# EAGLE design LCD-OLINUXINO-10''TS (EAGLE 4.16)
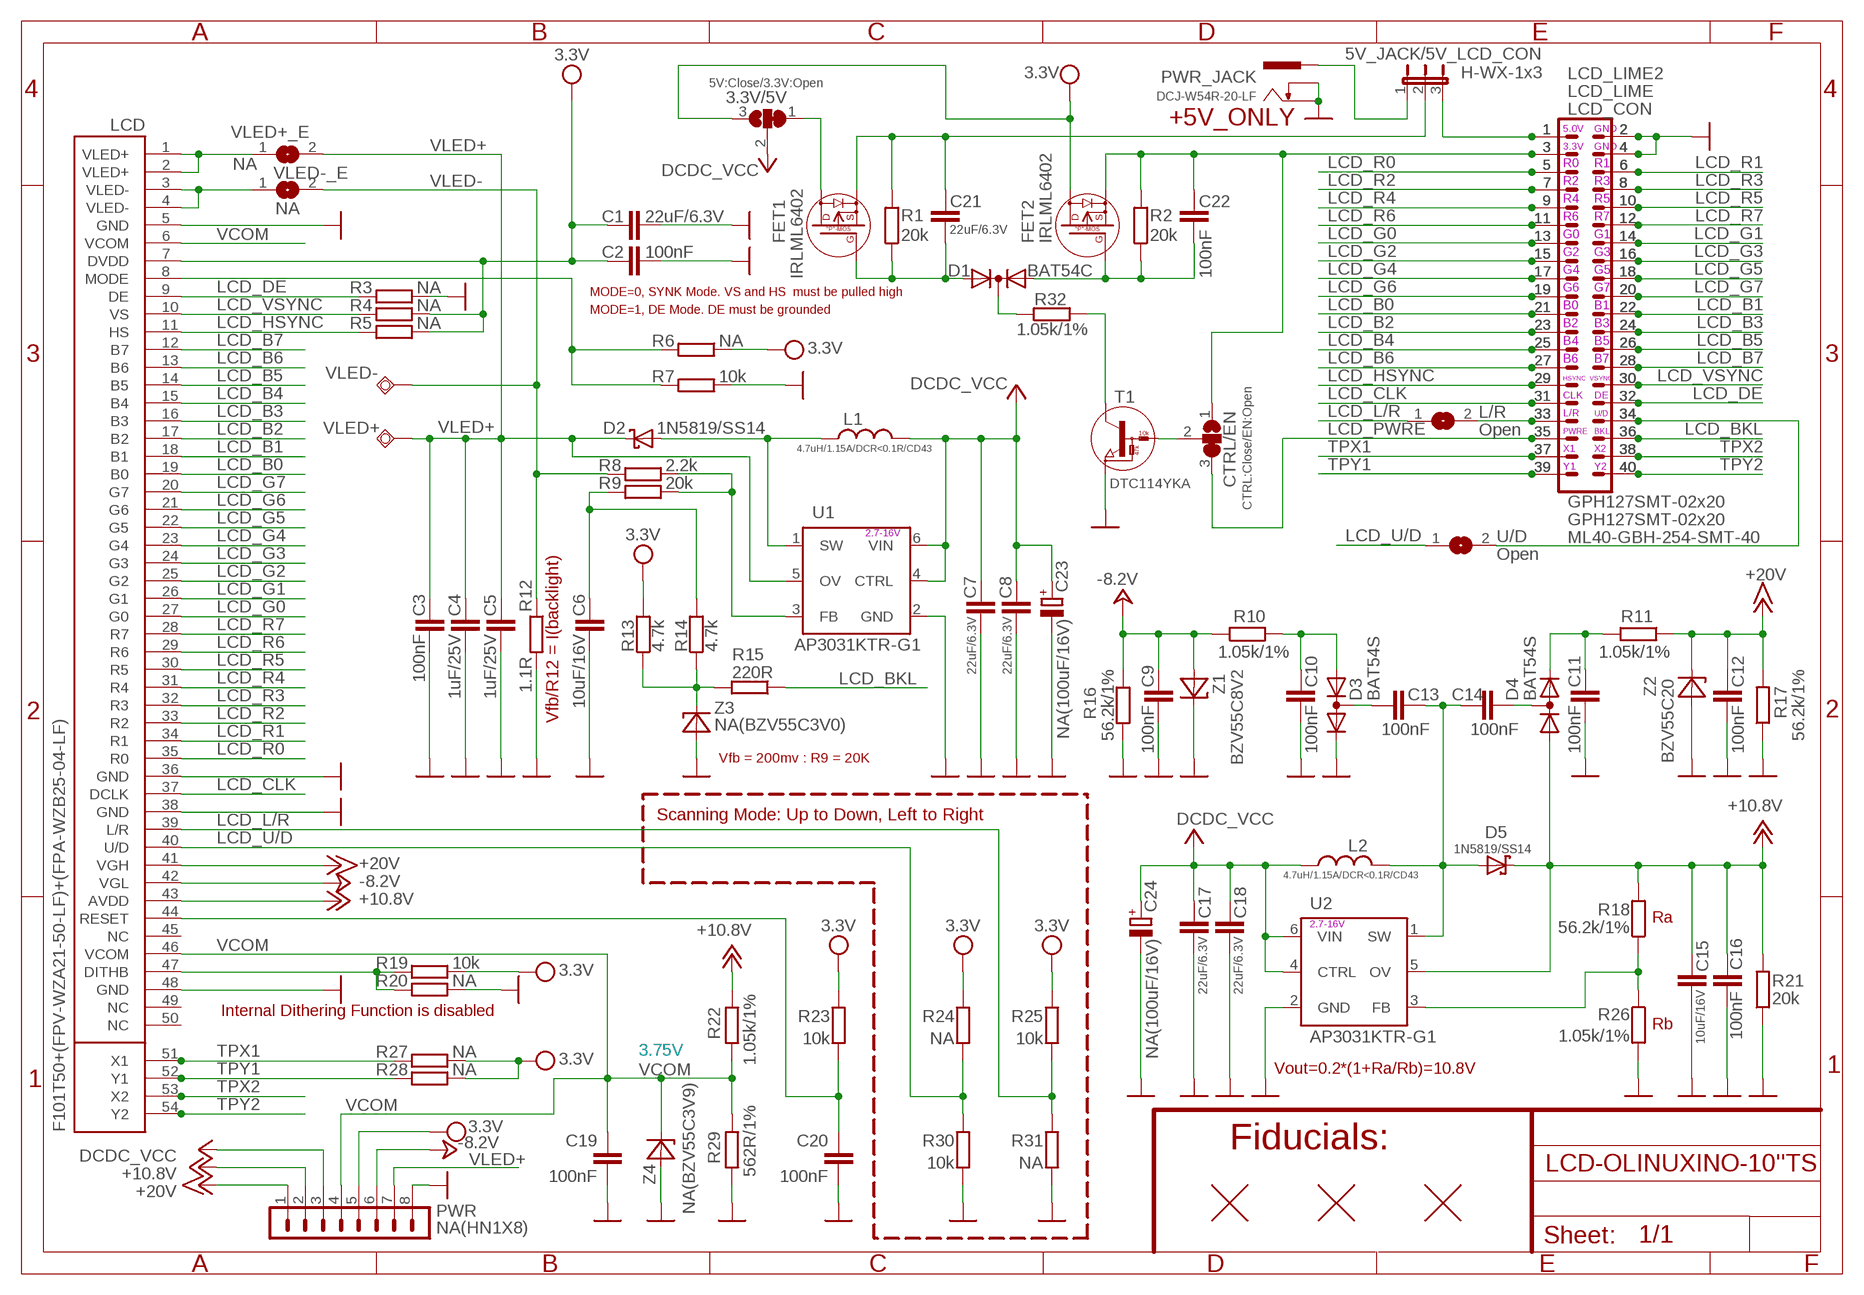
[diagram p0: schematic, sheet 1]

## Parts
3.3V/5V  5V:Close/3.3V:Open  SJ2W6  [SJ_2_SMALL_12_TIED]
5V_JACK/5V_LCD_CON  H-WX-1x3  JP2EHN1X3-SMD  [HN1X3-SMD]
C1  22uF/6.3V  C-EUC0805_5MIL_DWS  [C0805_5MIL_DWS]
C2  100nF  C-EUC0603_DWS  [C0603_DWS]
C3  100nF  C-EUC0603_DWS  [C0603_DWS]
C4  1uF/25V  C-EUC0805_5MIL_DWS  [C0805_5MIL_DWS]
C5  1uF/25V  C-EUC0805_5MIL_DWS  [C0805_5MIL_DWS]
C6  10uF/16V  C-EUC0805_5MIL_DWS  [C0805_5MIL_DWS]
C7  22uF/6.3V  C-EUC0805_5MIL_DWS  [C0805_5MIL_DWS]
C8  22uF/6.3V  C-EUC0805_5MIL_DWS  [C0805_5MIL_DWS]
C9  100nF  C-EUC0603_DWS  [C0603_DWS]
C10  100nF  C-EUC0603_DWS  [C0603_DWS]
C11  100nF  C-EUC0603_DWS  [C0603_DWS]
C12  100nF  C-EUC0603_DWS  [C0603_DWS]
C13  100nF  C-EUC0603_DWS  [C0603_DWS]
C14  100nF  C-EUC0603_DWS  [C0603_DWS]
C15  10uF/16V  C-EUC0805_5MIL_DWS  [C0805_5MIL_DWS]
C16  100nF  C-EUC0603_DWS  [C0603_DWS]
C17  22uF/6.3V  C-EUC0805_5MIL_DWS  [C0805_5MIL_DWS]
C18  22uF/6.3V  C-EUC0805_5MIL_DWS  [C0805_5MIL_DWS]
C19  100nF  C-EUC0603_DWS  [C0603_DWS]
C20  100nF  C-EUC0603_DWS  [C0603_DWS]
C21  22uF/6.3V  C-EUC0603_DWS  [C0603_DWS]
C22  100nF  C-EUC0603_DWS  [C0603_DWS]
C23  NA(100uF/16V)  CPOL-EUC-SMD5X11-M  [C-SMD5X11-M]
C24  NA(100uF/16V)  CPOL-EUC-SMD5X11-M  [C-SMD5X11-M]
CTRL/EN  CTRL:Close/EN:Open  SJ2W5  [SJ_2_SMALL_23_TIED]
D1  BAT54C  DIODE_AC-CA_  [SOT23C]
D2  1N5819/SS14  SCHOTKKY7.62SS2  [MLL-41]
D3  BAT54S  DIODE_AC-AC_  [SOT23C(BAT54S)]
D4  BAT54S  DIODE_AC-AC_  [SOT23C(BAT54S)]
D5  1N5819/SS14  SCHOTKKY7.62SS2  [MLL-41]
FET1  IRLML6402  P-MOS+DIODIRLML6402  [SOT23]
FET2  IRLML6402  P-MOS+DIODIRLML6402  [SOT23]
L1  4.7uH/1.15A/DCR<0.1R/CD43  L-CD42(43)  [CD42(43)]
L2  4.7uH/1.15A/DCR<0.1R/CD43  L-CD42(43)  [CD42(43)]
L/R  Open  SJ  [SJ]
LCD  F101T50+(FPV-WZA21-50-LF)+(FPA-WZB25-04-LF)  LCD10"_TOUCH-F101T50  [LCD10"_TOUCH(F101T50)]
LCD_CON  ML40-GBH-254-SMT-40  [ML40-MALE(GBH-254-SMT-40)]
LCD_LIME  GPH127SMT-02x20  ML40YA-V36P-2X20-LF  [YA-V36P-2X20-LF]
LCD_LIME2  GPH127SMT-02x20  ML40-GPH127SMT-02X20(PA-V16X-2X20-LF)  [GPH127SMT-02X20(PA-V16X-2X20-LF)]
PWR  NA(HN1X8)  CON8HN1X8  [HN1X8]
PWR_JACK  DCJ-W54R-20-LF  PWR-JAKDCJ-W  [PWR-JACK-SMD]
R1  20k  R-EU_R0603_5MIL_DWS  [R0603_5MIL_DWS]
R2  20k  R-EU_R0603_5MIL_DWS  [R0603_5MIL_DWS]
R3  NA  R-EU_R0603_5MIL_DWS  [R0603_5MIL_DWS]
R4  NA  R-EU_R0603_5MIL_DWS  [R0603_5MIL_DWS]
R5  NA  R-EU_R0603_5MIL_DWS  [R0603_5MIL_DWS]
R6  NA  R-EU_R0603_5MIL_DWS  [R0603_5MIL_DWS]
R7  10k  R-EU_R0603_5MIL_DWS  [R0603_5MIL_DWS]
R8  2.2k  R-EU_R0603_5MIL_DWS  [R0603_5MIL_DWS]
R9  20k  R-EU_R0603_5MIL_DWS  [R0603_5MIL_DWS]
R10  1.05k/1%  R-EU_R0603_5MIL_DWS  [R0603_5MIL_DWS]
R11  1.05k/1%  R-EU_R0603_5MIL_DWS  [R0603_5MIL_DWS]
R12  1.1R  R-EU_R0603_5MIL_DWS  [R0603_5MIL_DWS]
R13  4.7k  R-EU_R0603_5MIL_DWS  [R0603_5MIL_DWS]
R14  4.7k  R-EU_R0603_5MIL_DWS  [R0603_5MIL_DWS]
R15  220R  R-EU_R0603_5MIL_DWS  [R0603_5MIL_DWS]
R16  56.2k/1%  R-EU_R0603_5MIL_DWS  [R0603_5MIL_DWS]
R17  56.2k/1%  R-EU_R0603_5MIL_DWS  [R0603_5MIL_DWS]
R18  56.2k/1%  R-EU_R0603_5MIL_DWS  [R0603_5MIL_DWS]
R19  10k  R-EU_R0603_5MIL_DWS  [R0603_5MIL_DWS]
R20  NA  R-EU_R0603_5MIL_DWS  [R0603_5MIL_DWS]
R21  20k  R-EU_R0603_5MIL_DWS  [R0603_5MIL_DWS]
R22  1.05k/1%  R-EU_R0603_5MIL_DWS  [R0603_5MIL_DWS]
R23  10k  R-EU_R0603_5MIL_DWS  [R0603_5MIL_DWS]
R24  NA  R-EU_R0603_5MIL_DWS  [R0603_5MIL_DWS]
R25  10k  R-EU_R0603_5MIL_DWS  [R0603_5MIL_DWS]
R26  1.05k/1%  R-EU_R0603_5MIL_DWS  [R0603_5MIL_DWS]
R27  NA  R-EU_R0603_5MIL_DWS  [R0603_5MIL_DWS]
R28  NA  R-EU_R0603_5MIL_DWS  [R0603_5MIL_DWS]
R29  562R/1%  R-EU_R0603_5MIL_DWS  [R0603_5MIL_DWS]
R30  10k  R-EU_R0603_5MIL_DWS  [R0603_5MIL_DWS]
R31  NA  R-EU_R0603_5MIL_DWS  [R0603_5MIL_DWS]
R32  1.05k/1%  R-EU_R0603_5MIL_DWS  [R0603_5MIL_DWS]
T1  DTC114YKA  DIGITAL_TRANSISTORS-NPNDTC114YKA  [SOT-23]
U1  AP3031KTR-G1  [SOT23-6]
U2  AP3031KTR-G1  [SOT23-6]
U$1  FIDUCIAL  [FIDUCIAL-1X3]
U$2  FIDUCIAL  [FIDUCIAL-1X3]
U$3  FIDUCIAL  [FIDUCIAL-1X3]
U/D  Open  SJ  [SJ]
VLED+  TESTPAD120X40  [SMD120X40]
VLED+_E  NA  SJ  [SJ]
VLED-  TESTPAD120X40  [SMD120X40]
VLED-_E  NA  SJ  [SJ]
Z1  BZV55C8V2  ZDIOD-SMD  [MINI-MELF]
Z2  BZV55C20  ZDIOD-SMD  [MINI-MELF]
Z3  NA(BZV55C3V0)  ZDIOD-SMD  [MINI-MELF]
Z4  NA(BZV55C3V9)  ZDIOD-SMD  [MINI-MELF]

## Nets
+5V: 3.3V/5V.2 C7.2 C8.2 C17.2 C18.2 C23.+ C24.+ L1.1 L2.1 PWR.3 U1.4(CTRL) U1.6(VIN) U2.4(CTRL) U2.6(VIN) ; supply symbol labelled DCDC_VCC
+12V: C15.1 C16.1 D4.1(A) D5.K(C) LCD.43(AVDD) PWR.2 R18.2 R21.2 R22.1 U2.5(OV) ; supply symbol labelled +10.8V
+15V: C12.1 LCD.41(VGH) PWR.1 R11.1 R17.2 Z2.1(C) ; supply symbol labelled +20V
-24V: C9.1 LCD.42(VGL) PWR.6 R10.1 R16.2 Z1.2(A) ; supply symbol labelled -8.2V
GND [pwr]: C1.2 C2.2 C3.2 C4.2 C5.2 C6.2 C7.1 C8.1 C9.2 C10.2 C11.2 C12.2 C15.2 C16.2 C17.1 C18.1 C19.2 C20.2 C23.- C24.- D3.2(K) LCD.5(GND) LCD.36(GND) LCD.38(GND) LCD.48(GND) LCD_CON.2 LCD_CON.4 LCD_LIME2.2 LCD_LIME2.4 LCD_LIME.2 LCD_LIME.4 PWR.8 PWR_JACK.2(-) PWR_JACK.3(--) R3.1 R7.1 R12.2 R16.1 R17.1 R20.1 R21.1 R26.2 R29.2 R30.2 R31.2 T1.2(E) U1.2(GND) U2.2(GND) Z1.1(C) Z2.2(A) Z3.2(A) Z4.2(A)
LCD_B0: LCD.19(B0) LCD_CON.21 LCD_LIME2.21 LCD_LIME.21
LCD_B1: LCD.18(B1) LCD_CON.22 LCD_LIME2.22 LCD_LIME.22
LCD_B2: LCD.17(B2) LCD_CON.23 LCD_LIME2.23 LCD_LIME.23
LCD_B3: LCD.16(B3) LCD_CON.24 LCD_LIME2.24 LCD_LIME.24
LCD_B4: LCD.15(B4) LCD_CON.25 LCD_LIME2.25 LCD_LIME.25
LCD_B5: LCD.14(B5) LCD_CON.26 LCD_LIME2.26 LCD_LIME.26
LCD_B6: LCD.13(B6) LCD_CON.27 LCD_LIME2.27 LCD_LIME.27
LCD_B7: LCD.12(B7) LCD_CON.28 LCD_LIME2.28 LCD_LIME.28
LCD_BKL: LCD_CON.36 LCD_LIME2.36 LCD_LIME.36 R15.1
LCD_CLK: LCD.37(DCLK) LCD_CON.31 LCD_LIME2.31 LCD_LIME.31
LCD_DE: LCD.9(DE) LCD_CON.32 LCD_LIME2.32 LCD_LIME.32 R3.2
LCD_G0: LCD.27(G0) LCD_CON.13 LCD_LIME2.13 LCD_LIME.13
LCD_G1: LCD.26(G1) LCD_CON.14 LCD_LIME2.14 LCD_LIME.14
LCD_G2: LCD.25(G2) LCD_CON.15 LCD_LIME2.15 LCD_LIME.15
LCD_G3: LCD.24(G3) LCD_CON.16 LCD_LIME2.16 LCD_LIME.16
LCD_G4: LCD.23(G4) LCD_CON.17 LCD_LIME2.17 LCD_LIME.17
LCD_G5: LCD.22(G5) LCD_CON.18 LCD_LIME2.18 LCD_LIME.18
LCD_G6: LCD.21(G6) LCD_CON.19 LCD_LIME2.19 LCD_LIME.19
LCD_G7: LCD.20(G7) LCD_CON.20 LCD_LIME2.20 LCD_LIME.20
LCD_HSYNC: LCD.11(HS) LCD_CON.29 LCD_LIME2.29 LCD_LIME.29 R5.2
LCD_L/R: L/R.1 LCD.39(L/R) R25.2 R31.1
LCD_PWRE: CTRL/EN.3 LCD_CON.35 LCD_LIME2.35 LCD_LIME.35
LCD_R0: LCD.35(R0) LCD_CON.5 LCD_LIME2.5 LCD_LIME.5
LCD_R1: LCD.34(R1) LCD_CON.6 LCD_LIME2.6 LCD_LIME.6
LCD_R2: LCD.33(R2) LCD_CON.7 LCD_LIME2.7 LCD_LIME.7
LCD_R3: LCD.32(R3) LCD_CON.8 LCD_LIME2.8 LCD_LIME.8
LCD_R4: LCD.31(R4) LCD_CON.9 LCD_LIME2.9 LCD_LIME.9
LCD_R5: LCD.30(R5) LCD_CON.10 LCD_LIME2.10 LCD_LIME.10
LCD_R6: LCD.29(R6) LCD_CON.11 LCD_LIME2.11 LCD_LIME.11
LCD_R7: LCD.28(R7) LCD_CON.12 LCD_LIME2.12 LCD_LIME.12
LCD_U/D: LCD.40(U/D) R24.2 R30.1 U/D.1
LCD_VSYNC: LCD.10(VS) LCD_CON.30 LCD_LIME2.30 LCD_LIME.30 R4.2
N$1: LCD.8(MODE) R6.2 R7.2
N$2: C14.2 D4.3(AK)
N$3 [pwr]: C22.1 CTRL/EN.1 FET2.2(S) LCD_CON.3 LCD_LIME2.3 LCD_LIME.3 R2.2
N$4: C11.1 D4.2(K) R11.2
N$5: R8.1 R9.1 U1.3(FB)
N$6: C10.1 D3.1(A) R10.2
N$7: 5V_JACK/5V_LCD_CON.2 C21.1 FET1.2(S) R1.2
N$8: C22.2 D1.1(A1) FET2.1(G) R2.1
N$9: C21.2 D1.2(A2) FET1.1(G) R1.1
N$10: C13.1 D3.3(AK)
N$11: R32.1 T1.3(C)
N$12: C6.1 R9.2 R14.2
N$13: D2.A L1.2 U1.1(SW)
N$14: R13.1 R14.1 R15.2 Z3.1(C)
N$15: L/R.2 LCD_CON.33 LCD_LIME2.33 LCD_LIME.33
N$16: CTRL/EN.2 T1.1(B)
N$17: LCD_CON.34 LCD_LIME2.34 LCD_LIME.34 U/D.2
N$18: 3.3V/5V.1 FET1.3(D)
N$19: D1.3(K) R32.2
N$20: 5V_JACK/5V_LCD_CON.3 LCD_CON.1 LCD_LIME2.1 LCD_LIME.1
N$21: LCD.1(VLED+) LCD.2(VLED+) VLED+_E.1
N$22: 5V_JACK/5V_LCD_CON.1 PWR_JACK.1(+)
N$23: LCD.3(VLED-) LCD.4(VLED-) VLED-_E.1
N$42: LCD.47(DITHB) R19.2 R20.2
N$123: C13.2 C14.1 D5.A L2.2 U2.1(SW)
N$126: R18.1 R26.1 U2.3(FB)
RESET: C20.1 LCD.44(RESET) R23.2
TPX1: LCD.51(X1) LCD.55(X1_1) LCD_CON.37 LCD_LIME2.37 LCD_LIME.37 R27.2
TPX2: LCD.53(X2) LCD.57(X2_2) LCD_CON.38 LCD_LIME2.38 LCD_LIME.38
TPY1: LCD.52(Y1) LCD.56(Y1_1) LCD_CON.39 LCD_LIME2.39 LCD_LIME.39 R28.2
TPY2: LCD.54(Y2) LCD.58(Y2_2) LCD_CON.40 LCD_LIME2.40 LCD_LIME.40
VCC [pwr]: 3.3V/5V.3 C1.1 C2.1 FET2.3(D) LCD.7(DVDD) PWR.5 R4.1 R5.1 R6.1 R13.2 R19.1 R23.1 R24.1 R25.1 R27.1 R28.1 ; supply symbol labelled 3.3V
VCOM: C19.1 LCD.6(VCOM) LCD.46(VCOM) PWR.4 R22.2 R29.1 Z4.1(C)
VLED+: C3.1 C4.1 C5.1 D2.K(C) PWR.7 U1.5(OV) VLED+.1(PP) VLED+_E.2
VLED-: R8.2 R12.1 VLED-.1(PP) VLED-_E.2
Unconnected: LCD.45(NC) LCD.49(NC) LCD.50(NC)

## Notes on the sheet
- +5V_ONLY
- 5.0V | GND
- 3.3V | GND
- R0 | R1
- R2 | R3
- R4 | R5
- R6 | R7
- G0 | G1
- G2 | G3
- G4 | G5
- G6 | G7
- MODE=0, SYNK Mode. VS and HS  must be pulled high
- B0 | B1
- MODE=1, DE Mode. DE must be grounded
- B2 | B3
- B4 | B5
- B6 | B7
- HSYNC | VSYNC
- CLK | DE
- L/R | U/D
- PWRE | BKL
- X1 | X2
- Y1 | Y2
- 2.7-16V
- Vfb/R12 = I(backlight)
- Vfb = 200mv : R9 = 20K
- Scanning Mode: Up to Down, Left to Right
- Ra
- 2.7-16V
- Internal Dithering Function is disabled
- Rb
- 3.75V
- Vout=0.2*(1+Ra/Rb)=10.8V
- Fiducials:

## Library data of the parts
3.3V/5V CTRL/EN = jumper:SJ2W: SMD solder JUMPER
5V_JACK/5V_LCD_CON = jumper:JP2E: JUMPER
C1-C22 = rcl:C-EU: CAPACITOR, European symbol
C23 C24 = rcl:CPOL-EU: POLARIZED CAPACITOR, European symbol
D1 = semicon-smd-ipc:DIODE_AC-CA_: DUAL DIODE
D2 D5 = gogo:SCHOTKKY7.62SS
D3 D4 = semicon-smd-ipc:DIODE_AC-AC_: DUAL DIODE
FET1 FET2 = Penko:P-MOS+DIOD
L1 L2 = OLIMEX_DISCRET:L
L/R U/D VLED+_E VLED-_E = jumper:SJ: SMD solder JUMPER
LCD = olimex_lcd:LCD10"_TOUCH
LCD_CON LCD_LIME LCD_LIME2 = con-harting-ml:ML40: HARTING
PWR = Penko:CON8
PWR_JACK = gogo:PWR-JAK
R1-R32 = rcl:R-EU_: RESISTOR, European symbol
T1 = OLIMEX_DISCRET:DIGITAL_TRANSISTORS-NPN: DTC114YKA Digital Transistor - NPN
U1 U2 = OLIMEX_IC:AP3031
U$1-U$3 = SparkFunEagle-6-6-07:FIDUCIAL: Fiducial Alignment Points Various fiducial points for machine vision alignment.
VLED+ VLED- = gogo:TESTPAD: drill 40mils, diameter 70mils
Z1-Z4 = gogo:ZDIOD-SMD

## Net classes
1 pwr: width 0.254 mm, drill 0.241 mm, clearance 0.254 mm

## Board
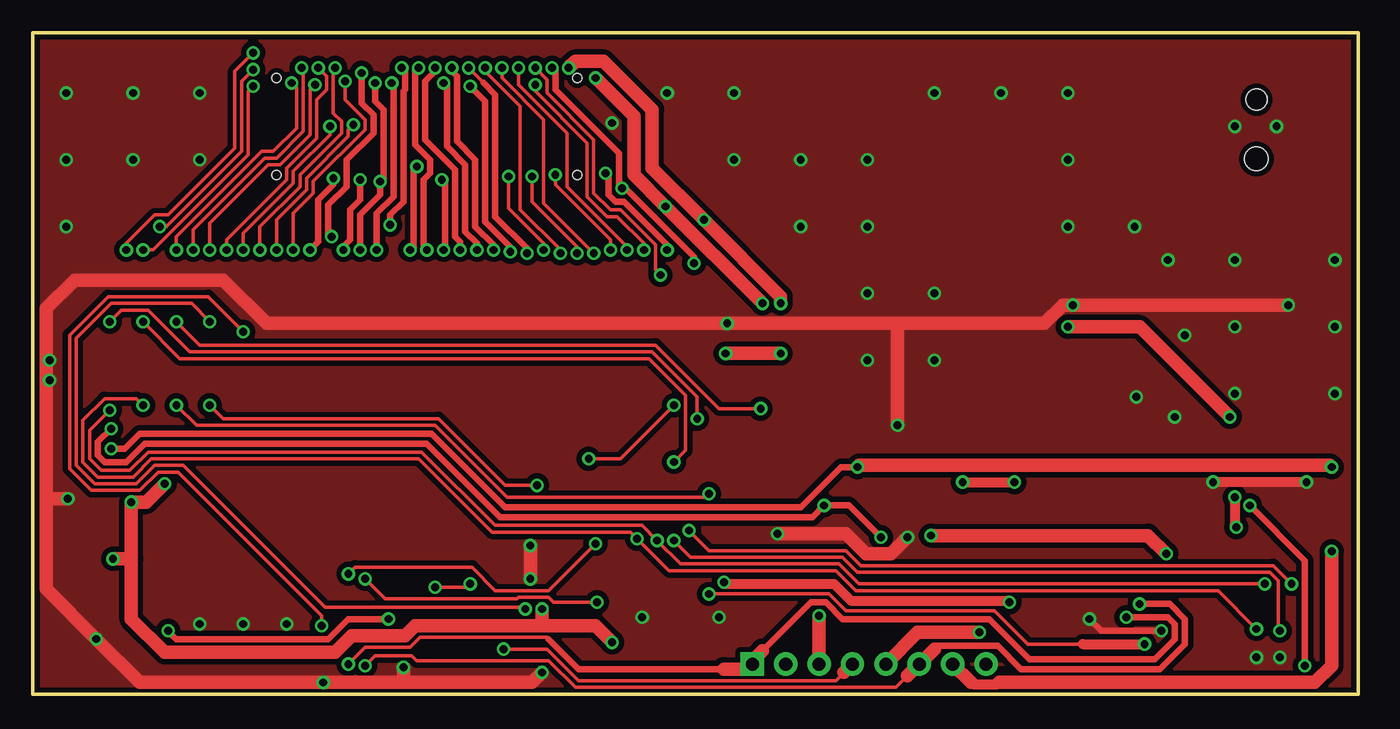
[diagram p1: board, top side]
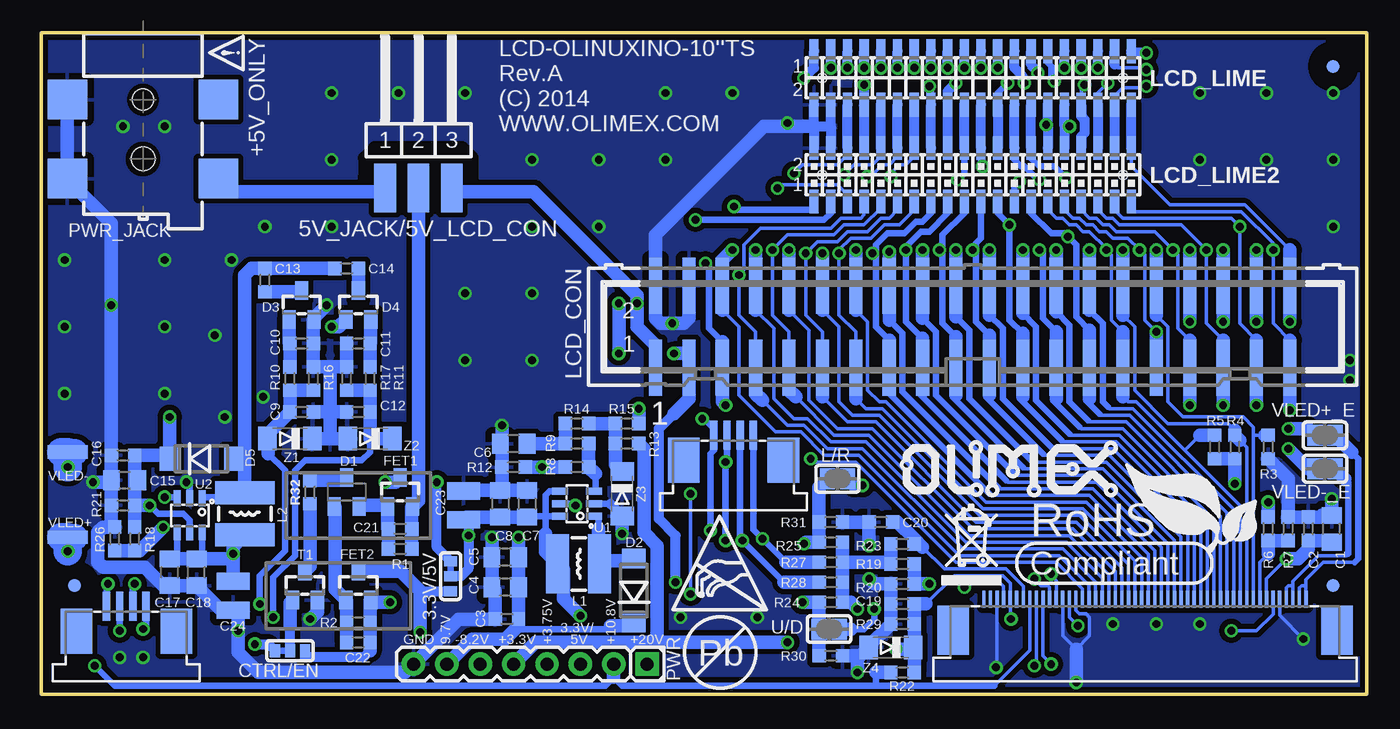
[diagram p2: board, bottom side, seen from below]

Size 100.84 x 50.29 mm. Coordinates in mm from the lower left corner, seen from the top.
Outline: 0,0 100.84,0 100.84,50.29 0,50.29 0,0
Copper layers (1+16): Top 0.035mm / dielectric 1.5mm / Bottom 0.035mm
Design rules "default": minimum track width 9.5mil, minimum drill 0.6mm, track to track 9.5mil, track to pad 9.5mil, pad to pad 9.5mil, via to via 9.5mil, smd to smd 1mil, copper to edge 10mil, drill to drill 8mil, minimum pad ring 8mil, minimum via ring 8mil, stop-mask expansion 4mil, vias tented up to drill 25mil, thermal gap 20mil
bRestrict: 5 lines

### Footprints (pad centres in the part's own frame; a part is rotated, then mirrored left to right if it is on the bottom)
SJ_2_SMALL_12_TIED = smd 0.762 x 1.016: 1 -1.143,0; 2 0,0; 3 1.143,0
HN1X3-SMD = smd 1.651 x 3.683: 1 -2.54,-0.229; 2 0,-0.229; 3 2.54,-0.229
C0805_5MIL_DWS = smd 1.27 x 1.524: 1 -1.016,0; 2 1.016,0
C0603_DWS = smd 1.016 x 1.016: 1 -0.889,0; 2 0.889,0
C-SMD5X11-M = smd 2.5 x 1.3: + 0,-1.1; - 0,1.1
SJ_2_SMALL_23_TIED = smd 0.762 x 1.016: 1 -1.143,0; 2 0,0; 3 1.143,0
SOT23C = smd 1.4 x 1: 1 1.1,-0.95; 2 1.1,0.95; 3 -1.1,0
MLL-41 = smd 1.45 x 1.8: A 2.445,0; K -2.445,0
SOT23C(BAT54S) = smd 1.4 x 1: 1 1.1,-0.95; 2 1.1,0.95; 3 -1.1,0
SOT23 = smd 1.4 x 1: 1 1.1,-0.95; 2 1.1,0.95; 3 -1.1,0
CD42(43) = smd 1.75 x 4.5: 1 -1.6,0; 2 1.6,0
SJ = smd 1.168 x 1.6: 1 -0.762,0; 2 0.762,0
LCD10"_TOUCH(F101T50) = smd 0.25 x 1.3 bottom: 1 104.95,54.35; 2 105.45,54.35; 3 105.95,54.35; 4 106.45,54.35; 5 106.95,54.35; 6 107.45,54.35; 7 107.95,54.35; 8 108.45,54.35; 9 108.95,54.35; 10 109.45,54.35; 11 109.95,54.35; 12 110.45,54.35; 13 110.95,54.35; 14 111.45,54.35; 15 111.95,54.35; 16 112.45,54.35; 17 112.95,54.35; 18 113.45,54.35; 19 113.95,54.35; 20 114.45,54.35; 21 114.95,54.35; 22 115.45,54.35; 23 115.95,54.35; 24 116.45,54.35; 25 116.95,54.35; 26 117.45,54.35; 27 117.95,54.35; 28 118.45,54.35; 29 118.95,54.35; 30 119.45,54.35; 31 119.95,54.35; 32 120.45,54.35; 33 120.95,54.35; 34 121.45,54.35; 35 121.95,54.35; 36 122.45,54.35; 37 122.95,54.35; 38 123.45,54.35; 39 123.95,54.35; 40 124.45,54.35; 41 124.95,54.35; 42 125.45,54.35; 43 125.95,54.35; 44 126.45,54.35; 45 126.95,54.35; 46 127.45,54.35; 47 127.95,54.35; 48 128.45,54.35; 49 128.95,54.35; 50 129.45,54.35 | smd 0.55 x 2.2 bottom: 51 193.195,53.799; 52 194.195,53.799; 53 195.195,53.799; 54 196.195,53.799; 55 146.995,66.799; 56 147.995,66.799; 57 148.995,66.799; 58 149.995,66.799 | smd 2.4 x 3.7 bottom: P1 131.8,51.975; P2 102.6,51.975 | smd 2.4 x 3.4 bottom: P3 190.895,51.899; P4 198.495,51.899; P5 144.695,64.899; P6 152.295,64.899
ML40-MALE(GBH-254-SMT-40) = smd 1 x 4.25: 1 -24.13,-3.125; 2 -24.13,3.125; 3 -21.59,-3.125; 4 -21.59,3.125; 5 -19.05,-3.125; 6 -19.05,3.125; 7 -16.51,-3.125; 8 -16.51,3.125; 9 -13.97,-3.125; 10 -13.97,3.125; 11 -11.43,-3.125; 12 -11.43,3.125; 13 -8.89,-3.125; 14 -8.89,3.125; 15 -6.35,-3.125; 16 -6.35,3.125; 17 -3.81,-3.125; 18 -3.81,3.125; 19 -1.27,-3.125; 20 -1.27,3.125; 21 1.27,-3.125; 22 1.27,3.125; 23 3.81,-3.125; 24 3.81,3.125; 25 6.35,-3.125; 26 6.35,3.125; 27 8.89,-3.125; 28 8.89,3.125; 29 11.43,-3.125; 30 11.43,3.125; 31 13.97,-3.125; 32 13.97,3.125; 33 16.51,-3.125; 34 16.51,3.125; 35 19.05,-3.125; 36 19.05,3.125; 37 21.59,-3.125; 38 21.59,3.125; 39 24.13,-3.125; 40 24.13,3.125
YA-V36P-2X20-LF = smd 0.7 x 1.8: 1 -12.065,2.032; 2 -12.065,-2.032; 3 -10.795,2.032; 4 -10.795,-2.032; 5 -9.525,2.032; 6 -9.525,-2.032; 7 -8.255,2.032; 8 -8.255,-2.032; 9 -6.985,2.032; 10 -6.985,-2.032; 11 -5.715,2.032; 12 -5.715,-2.032; 13 -4.445,2.032; 14 -4.445,-2.032; 15 -3.175,2.032; 16 -3.175,-2.032; 17 -1.905,2.032; 18 -1.905,-2.032; 19 -0.635,2.032; 20 -0.635,-2.032; 21 0.635,2.032; 22 0.635,-2.032; 23 1.905,2.032; 24 1.905,-2.032; 25 3.175,2.032; 26 3.175,-2.032; 27 4.445,2.032; 28 4.445,-2.032; 29 5.715,2.032; 30 5.715,-2.032; 31 6.985,2.032; 32 6.985,-2.032; 33 8.255,2.032; 34 8.255,-2.032; 35 9.525,2.032; 36 9.525,-2.032; 37 10.795,2.032; 38 10.795,-2.032; 39 12.065,2.032; 40 12.065,-2.032 | hole 0.7: -11.43,0; 11.43,0
GPH127SMT-02X20(PA-V16X-2X20-LF) = smd 0.7 x 1.8: 1 -12.065,-2.032; 2 -12.065,2.032; 3 -10.795,-2.032; 4 -10.795,2.032; 5 -9.525,-2.032; 6 -9.525,2.032; 7 -8.255,-2.032; 8 -8.255,2.032; 9 -6.985,-2.032; 10 -6.985,2.032; 11 -5.715,-2.032; 12 -5.715,2.032; 13 -4.445,-2.032; 14 -4.445,2.032; 15 -3.175,-2.032; 16 -3.175,2.032; 17 -1.905,-2.032; 18 -1.905,2.032; 19 -0.635,-2.032; 20 -0.635,2.032; 21 0.635,-2.032; 22 0.635,2.032; 23 1.905,-2.032; 24 1.905,2.032; 25 3.175,-2.032; 26 3.175,2.032; 27 4.445,-2.032; 28 4.445,2.032; 29 5.715,-2.032; 30 5.715,2.032; 31 6.985,-2.032; 32 6.985,2.032; 33 8.255,-2.032; 34 8.255,2.032; 35 9.525,-2.032; 36 9.525,2.032; 37 10.795,-2.032; 38 10.795,2.032; 39 12.065,-2.032; 40 12.065,2.032 | hole 0.7: -11.43,0; 11.43,0
HN1X8 = drill 1 pad 1.778 square: 1 -8.89,0 | drill 1 pad 1.778 round: 2 -6.35,0; 3 -3.81,0; 4 -1.27,0; 5 1.27,0; 6 3.81,0; 7 6.35,0; 8 8.89,0
PWR-JACK-SMD = smd 3 x 3: 1 6,5.75; 2 0,-5.75; 3 6,-5.75; 4 0,5.75 | hole 1.6: 0,0 | hole 1.8: 4.5,0
R0603_5MIL_DWS = smd 1.016 x 1.016: 1 -0.889,0; 2 0.889,0
SOT-23 = smd 1.4 x 1: 1 1.1,-0.95; 2 1.1,0.95; 3 -1.1,0
SOT23-6 = smd 1.2 x 0.55: 1 1.3,-0.95; 2 1.3,0; 3 1.3,0.95; 4 -1.3,0.95; 5 -1.3,0; 6 -1.3,-0.95
FIDUCIAL-1X3 = smd 1 x 1: 1 0,0
SMD120X40 = smd 3.048 x 1.016: 1 0,0
MINI-MELF = smd 1.4 x 1.8: 1 -1.7,0; 2 1.7,0

### Placement (x,y rotation side)
3.3V/5V  69.69,8.97 270 bottom
5V_JACK/5V_LCD_CON  72.14,38.73 0 bottom
C1  2.67,12.57 90 bottom
C2  4.45,12.57 90 bottom
C3  65.41,5.71 180 bottom
C4  65.53,8.13 180 bottom
C5  65.53,10.41 180 bottom
C6  64.9,19.05 180 bottom
C7  63.88,14.48 270 bottom
C8  65.91,14.48 270 bottom
C9  81.03,21.46 0 bottom
C10  81.03,26.67 0 bottom
C11  76.71,26.67 180 bottom
C12  76.71,21.46 180 bottom
C13  83.82,31.5 90 bottom
C14  77.6,32.38 0 bottom
C15  94.49,16.26 180 bottom
C16  94.61,18.16 180 bottom
C17  91.06,9.27 90 bottom
C18  89.03,9.27 90 bottom
C19  35.31,6.86 180 bottom
C20  36.96,13.08 180 bottom
C21  73.53,12.57 180 bottom
C22  76.71,3.94 180 bottom
C23  68.71,14.35 0 bottom
C24  86.23,7.49 180 bottom
CTRL/EN  81.92,3.3 180 bottom
D1  77.6,15.37 270 bottom
D2  55.75,7.87 90 bottom
D3  81.03,29.59 270 bottom
D4  76.71,29.59 270 bottom
D5  88.65,17.91 0 bottom
FET1  73.53,15.37 270 bottom
FET2  76.71,8.26 270 bottom
L1  59.94,9.91 0 bottom
L2  85.34,13.72 90 bottom
L/R  40.26,16.38 0 bottom
LCD  -100.33,-47.12 0 top
LCD_CON  29.97,27.94 0 bottom
LCD_LIME  29.97,46.86 0 bottom
LCD_LIME2  29.97,39.5 0 bottom
PWR  63.63,2.29 180 bottom
PWR_JACK  93.09,45.21 270 bottom
R1  73.53,11.05 0 bottom
R2  76.71,5.46 0 bottom
R3  7.49,18.8 90 bottom
R4  10.03,18.8 90 bottom
R5  11.56,18.8 90 bottom
R6  7.49,12.57 270 bottom
R7  5.97,12.57 270 bottom
R8  60.07,17.27 180 bottom
R9  60.07,19.05 180 bottom
R10  81.92,24 90 bottom
R11  75.82,24 90 bottom
R12  64.9,17.27 180 bottom
R13  56.26,19.05 0 bottom
R14  60.07,20.57 180 bottom
R15  56.26,20.57 180 bottom
R16  80.14,24 270 bottom
R17  77.6,24 270 bottom
R18  93.73,11.81 90 bottom
R19  35.31,9.91 0 bottom
R20  35.31,8.38 0 bottom
R21  94.61,14.35 0 bottom
R22  35.31,1.65 0 bottom
R23  35.31,11.43 0 bottom
R24  40.77,6.99 180 bottom
R25  40.77,11.56 180 bottom
R26  95.25,11.81 90 bottom
R27  40.77,10.03 180 bottom
R28  40.77,8.51 180 bottom
R29  35.31,5.33 180 bottom
R30  40.77,2.92 0 bottom
R31  40.77,13.08 0 bottom
R32  80.39,15.37 90 bottom
T1  80.77,8.26 270 bottom
U1  60.07,14.48 0 bottom
U2  89.53,13.59 90 bottom
U$1  2.54,8.26 270 bottom
U$2  98.3,8.26 270 bottom
U$3  2.54,47.75 270 bottom
U$4  [ATTENTION_SMALL]  85.47,47.5 90 bottom
U$8  [OLIMEX1_V]  17.78,14.86 0 bottom
U$9  [PB]  49.18,3.18 0 bottom
U$10  [ESD_SYMBOL]  52.78,6.42 0 bottom
U$11  [RECYCLE_BIN1/8]  32.36,8.27 0 bottom
U$12  [ROHS]  25.61,9.06 0 bottom
U/D  40.89,4.95 0 bottom
VLED+  98.81,11.94 180 bottom
VLED+_E  3.17,19.68 180 bottom
VLED-  98.81,18.41 180 bottom
VLED-_E  3.17,17.14 180 bottom
Z1  81.92,19.43 180 bottom
Z2  75.82,19.43 180 bottom
Z3  56.64,15.24 270 bottom
Z4  36.2,3.56 180 bottom

### Tracks (layer width: path | path; a pad name or v marks a point on that pad's centre or on a via)
+5V  (via drill 0.6)
  Top 1.016: v68.33,12.06 84.84,12.06 v86.23,10.67 | PWR.3 v59.82,5.97
  Bottom 0.508: 62.48,13.53 63.81,13.53 C7.2 | U1.4 62.17,15.43 62.48,15.11 62.48,13.59 | U2.6 88.58,10.73 C18.2 | U2.4 90.48,10.86 C17.2 | 62.48,13.53 U1.6 | 62.48,13.59 62.48,13.53 | 62.48,12.19 62.48,13.59
  Bottom 0.762: 3.3V/5V.2 68.88,8.97 68.33,9.53 v68.33,12.06 68.33,12.87 C23.+
  Bottom 1.016: L2.1 86.23,11.23 v86.23,10.67 86.23,10.29 | 86.23,10.29 C24.+ | C17.2 C18.2 86.23,10.29 | C23.+ 68.5,13.46 C8.2 C7.2 | 62.48,12.19 62.48,10.85 L1.1 61.09,9.45 61.09,7.24 v59.82,5.97
+12V  (via drill 0.6)
  Top 0.508: v96.77,2.16 96.77,10.16 v92.58,14.35
  Top 1.016: v91.06,21.08 84.2,27.94 v78.74,27.94
  Bottom 0.254: LCD.43 25.62,3.34 28.32,0.64
  Bottom 0.508: v92.58,14.35 91.95,13.72 90.04,13.72 89.53,13.21 U2.5 | 28.32,0.64 37.34,0.64 | 37.34,0.64 56.64,0.64 57.28,1.27 57.91,0.64 95.25,0.64 v96.77,2.16 | 37.34,0.64 37.34,1.65
  Bottom 1.016: R21.2 93.73,16.26 C15.1 93.73,16.51 C16.1 91.34,18.16 D5.K 91.06,17.94 v91.06,21.08 | v92.58,14.35 R21.2 | R21.2 R18.2 | 37.34,1.65 R22.1 | 57.28,1.27 PWR.2 | D4.1 78.21,27.94 v78.74,27.94
+15V  (via drill 0.6)
  Top 0.254: v24,2.29 25.27,3.56 28.7,3.56 29.46,4.32 39.12,4.32 39.24,4.19
  Top 0.508: 39.24,4.19 41.53,1.91 52.58,1.91 | v83.19,5.84 86.36,5.84 86.87,5.33 86.87,4.19 85.34,2.67 75.82,2.67 72.77,5.71 61.59,5.71 60.33,6.99 59.18,6.99 55.5,3.3
  Top 1.016: 52.58,1.91 54.48,1.91 54.48,2.03 PWR.1 54.74,2.54 55.5,3.3
  Bottom 0.254: v24,2.29 24.62,2.9 LCD.41
  Bottom 0.508: v83.19,5.84 83.19,8.89 81.53,10.54 81.53,17.02 80.77,17.78 76.45,17.78 75.82,18.41 75.82,19.43
  Bottom 0.762: 74.12,19.35 Z2.1
  Bottom 1.016: R17.2 R11.1 C12.1 75.82,19.43 74.2,19.43 74.12,19.35
-24V  (via drill 0.6)
  Top 0.254: 66.55,1.4 65.66,0.51 41.27,0.51 39.24,2.54 29.21,2.54 28.83,2.92 26.04,2.92 v25.27,2.16
  Top 0.508: 68.58,3.43 68.83,3.68 73.41,3.68 75.18,1.91 85.72,1.91 87.63,3.81 87.63,5.71 86.49,6.86 v84.2,6.86
  Top 1.016: 68.58,3.43 PWR.6 66.55,1.4
  Bottom 0.254: LCD.42 25.12,2.31 v25.27,2.16
  Bottom 0.508: 83.57,18.29 82.3,17.02 82.3,10.92 84.2,9.02 v84.2,6.86
  Bottom 1.016: R16.2 R10.1 C9.1 83.61,19.76 Z1.2 83.57,19.38 83.57,18.29
GND  (via drill 0.6)
  Top 0.508: v80.39,5.71 81.28,4.83 v85.85,4.83
  Top 0.762: v96.9,16.13 v89.79,16.13
  Top 1.016: 1.02,14.86 1.02,29.34 3.17,31.5 14.48,31.5 17.78,28.19 v52.83,28.19 65.79,28.19 | 1.02,14.86 v2.67,14.86 | 1.02,14.86 1.02,8 v4.83,4.19 8.13,0.89 v22.1,0.89 28.19,0.89 | 28.19,0.89 37.97,0.89 v38.73,1.65 | 28.19,0.89 v28.19,2.03 | 65.79,28.19 76.96,28.19 78.36,29.59 v79.12,29.59 v95.5,29.59 | v37.85,8.76 v37.85,11.3 | v56.64,12.19 61.85,12.19 63.37,10.67 65.28,10.67 v66.55,11.94 | 65.79,28.19 v65.79,20.45
  Bottom 0.254: LCD.38 23.12,4.45 22.1,3.43 21.08,4.45 21.08,5.84 21.34,6.1 21.84,6.1 22.12,6.37 LCD.36 | LCD.48 28.12,2.11 v28.19,2.03 | LCD.5 6.62,5.99 v4.83,4.19
  Bottom 0.508: U2.2 89.53,15.88 v89.79,16.13 | 57.53,14.48 U1.2
  Bottom 0.762: Z3.2 56.64,13.59 57.53,14.48 | 40.77,43.18 LCD_LIME2.4 | 42.04,43.18 40.77,43.18 | 42.04,43.18 LCD_LIME2.2 | 40.77,43.18 LCD_LIME.4 | 42.04,43.18 LCD_LIME.2
  Bottom 1.016: R3.1 5.97,16.38 R7.1 C2.2 3.56,13.46 3.43,13.59 C1.2 v2.67,14.86 | C15.2 C16.2 v95.5,29.59 95.5,35.81 98.84,39.15 PWR_JACK.3 PWR_JACK.2 | C15.2 R21.1 95.5,12.95 R26.2 96.14,12.7 96.52,12.32 96.52,10.03 96.14,9.65 92.96,9.65 91.57,8.26 C17.1 C18.1 87.17,6.39 C24.- 85.85,6.01 v85.85,4.83 85.85,3.17 84.33,1.65 73.15,1.65 PWR.8 69.09,5.71 C3.2 66.29,7.87 C4.2 C5.2 v66.55,11.94 | C11.2 R17.1 78.87,24.89 | 78.87,19.43 Z2.2 | 78.87,19.43 Z1.1 | 78.87,24.89 R16.1 C10.2 80.14,28.43 D3.2 80.08,28.64 v79.12,29.59 | 78.87,24.89 78.87,21.46 | 78.87,21.46 C12.2 | 78.87,21.46 C9.2 | 78.87,21.46 78.87,19.43 | T1.2 79.82,6.28 v80.39,5.71 | C23.- 68.66,15.49 C8.1 | C8.1 C7.1 | C8.1 65.79,15.62 R12.2 65.79,19.05 | 38.73,2.92 38.53,2.92 Z4.2 37.9,3.63 R29.2 C19.2 R20.1 37.47,8.38 v37.85,8.76 | 38.73,2.92 R30.2 | v38.73,1.65 38.73,2.92 | v22.1,0.89 22.1,3.43 | v37.85,11.3 C20.2 R31.2 | C15.2 95.5,16.13 v96.9,16.13 | v56.64,12.19 Z3.2 | v65.79,20.45 65.79,19.05 | 65.79,19.05 C6.2 | LCD_CON.4 51.56,28.57 51.94,28.19 v52.83,28.19 53.72,28.19 54.1,28.57 LCD_CON.2 54.1,34.92 45.85,43.18 42.04,43.18
  other vias: 12.7,5.33 16,5.33 19.3,5.33 46.35,5.84 52.2,5.84 93.09,2.79 94.87,2.79 1.27,23.88 87.63,27.3 86.87,21.08 1.27,25.4 68.58,25.4 63.5,25.4 48.26,45.72 53.34,45.72 53.34,40.64 58.42,40.64 63.5,40.64 58.42,35.56 63.5,35.56 63.5,30.48 68.58,30.48 78.74,40.64 78.74,45.72 78.74,35.56 83.82,35.56 86.36,33.02 91.44,33.02 73.66,45.72 68.58,45.72 91.44,43.18 94.61,43.18 83.95,22.61 44.07,43.43 2.54,45.72 7.62,45.72 7.62,40.64 2.54,40.64 12.7,40.64 12.7,45.72 2.54,35.56 91.44,27.94 91.44,22.86 99.06,22.86 99.06,27.94 99.06,33.02
  pour Top (isolate 0.406, rank 2): -2.54,52.83 -2.54,-2.54 103.38,-2.54 103.38,52.83
  pour Bottom (isolate 0.406, rank 3): -5.08,-5.08 105.92,-5.08 105.92,55.37 -5.08,55.37
LCD_B0  (via drill 0.6)
  Top 0.508: v29.97,33.78 29.72,34.04 29.72,39.12 30.23,39.62 30.23,40.64 29.08,41.78 29.08,47.37 v29.34,47.62
  Bottom 0.254: LCD.19 13.62,12.22 19.56,18.16 24.51,18.16 24.64,18.29
  Bottom 0.508: 24.64,18.29 28.7,22.35 28.7,22.73 | 28.7,27.3 29.72,28.32 29.72,33.78 | LCD_LIME2.21 29.34,34.67 29.72,34.29 29.72,33.78 | 29.72,33.78 v29.97,33.78
  Bottom 0.762: v29.34,47.62 LCD_LIME.21
  Bottom 1.016: 28.7,22.73 LCD_CON.21 28.7,27.3
LCD_B1  (via drill 0.6)
  Top 0.508: v29.21,40.13 28.96,39.88 28.96,34.04 v28.7,33.78
  Bottom 0.254: LCD.18 13.12,12.48 19.3,18.67 23.88,18.67 24,18.8
  Bottom 0.508: 28.7,28.83 27.69,27.81 27.69,22.48 24,18.8 | v29.21,40.13 29.34,40.26 LCD_LIME2.22
  Bottom 0.762: LCD_LIME2.22 LCD_LIME.22
  Bottom 1.016: 28.7,28.83 LCD_CON.22 v28.7,33.78
LCD_B2  (via drill 0.6)
  Top 0.508: v27.18,35.69 27.18,36.45 28.19,37.47 28.19,45.85 28.32,45.97 28.32,47.37 v28.07,47.62
  Bottom 0.254: 23.24,19.3 23.11,19.18 19.05,19.18 12.62,12.75 LCD.17
  Bottom 0.508: 23.24,19.3 26.16,22.23 26.16,22.61 | 26.16,27.43 27.18,28.45 v27.18,35.69 28.07,36.58 LCD_LIME2.23
  Bottom 0.762: v28.07,47.62 LCD_LIME.23
  Bottom 1.016: 26.16,22.61 LCD_CON.23 26.16,27.43
LCD_B3  (via drill 0.6)
  Top 0.508: v26.16,33.78 26.16,36.58 27.43,37.85 27.43,46.35 v27.3,46.48
  Bottom 0.254: 22.61,19.81 22.48,19.68 18.8,19.68 12.12,13.01 LCD.16
  Bottom 0.508: 26.16,28.96 25.15,27.94 25.15,22.35 22.61,19.81 | v27.3,46.48 28.07,45.72 LCD_LIME.24
  Bottom 0.762: LCD_LIME.24 LCD_LIME2.24
  Bottom 1.016: 26.16,28.96 LCD_CON.24 v26.16,33.78
LCD_B4  (via drill 0.6)
  Top 0.508: v24.89,33.78 24.89,36.45 26.42,37.97 v26.42,38.99 26.67,39.24 26.67,44.45 26.04,45.09 v26.04,46.48
  Bottom 0.254: 21.84,20.32 21.72,20.19 18.54,20.19 11.62,13.27 LCD.15
  Bottom 0.508: 21.84,20.32 23.62,22.1 23.62,22.48 | 23.62,27.56 24.64,28.57 24.64,33.53 v24.89,33.78 | v26.42,38.99 26.8,38.61 LCD_LIME2.25
  Bottom 0.762: v26.04,46.48 26.16,46.61 26.16,46.99 26.8,47.62 LCD_LIME.25
  Bottom 1.016: 23.62,22.48 LCD_CON.25 23.62,27.56
LCD_B5  (via drill 0.6)
  Top 0.508: v24.89,39.12 24.89,37.59 24.13,36.83 24.13,34.54 23.62,34.04 v23.62,33.78
  Bottom 0.254: LCD.14 11.12,13.53 18.29,20.7 21.08,20.7 21.21,20.83
  Bottom 0.508: 23.62,29.08 22.61,28.07 22.61,22.23 21.21,20.83 | v24.89,39.12 25.02,39.12 26.04,40.13 26.29,40.13 26.8,40.64 LCD_LIME2.26
  Bottom 0.762: LCD_LIME2.26 LCD_LIME.26
  Bottom 1.016: 23.62,29.08 LCD_CON.26 v23.62,33.78
LCD_B6  (via drill 0.6)
  Top 0.508: v25.02,47.24 25.02,44.96 25.91,44.07 25.91,42.67 23.88,40.64 23.88,38.61 22.48,37.21 22.48,35.05 v22.73,34.8
  Bottom 0.254: LCD.13 10.62,13.79 18.03,21.21 20.19,21.21 20.32,21.34
  Bottom 0.508: 20.32,21.34 21.08,22.1 21.08,22.48 | 21.08,27.69 22.1,28.7 22.1,34.16 v22.73,34.8 22.99,35.05 24,35.05 25.53,36.58 LCD_LIME2.27
  Bottom 0.762: v25.02,47.24 25.02,47.37 25.53,47.88 LCD_LIME.27
  Bottom 1.016: 21.08,22.48 LCD_CON.27 21.08,27.69
LCD_B7  (via drill 0.6)
  Top 0.508: v21.08,33.78 21.72,34.42 21.72,37.59 22.86,38.73 v22.86,39.24
  Bottom 0.254: LCD.12 10.12,14.06 17.78,21.72 19.56,21.72 19.68,21.84
  Bottom 0.508: 21.08,29.21 20.07,28.19 20.07,22.23 19.68,21.84 | v22.86,39.24 23.75,40.13 24.89,40.13 25.53,40.77 LCD_LIME2.28
  Bottom 0.762: LCD_LIME2.28 LCD_LIME.28
  Bottom 1.016: 21.08,29.21 LCD_CON.28 v21.08,33.78
LCD_BKL  (via drill 0.6)
  Top 0.254: v10.92,28.32 12.7,26.54 47.37,26.54 52.2,21.72 v55.37,21.72 | v19.68,46.48 20.07,46.1 20.07,43.05 18.29,41.27 17.4,41.27 10.92,34.8 v10.92,33.78
  Bottom 0.254: LCD_LIME.36 20.45,45.72 v19.68,46.48
  Bottom 0.762: LCD_LIME.36 LCD_LIME2.36
  Bottom 1.016: v10.92,28.32 LCD_CON.36 v10.92,33.78 | v55.37,21.72 R15.1
LCD_CLK  (via drill 0.6)
  Top 0.254: v21.97,5.21 21.97,5.97 11.05,16.89 9.53,16.89 8.13,15.49 4.45,15.49 2.79,17.14 2.79,27.3 5.71,30.23 13.34,30.23 v16,27.56 | v22.99,47.62 22.86,47.5 22.86,44.2 23.5,43.56 23.5,42.67 20.32,39.5 20.32,38.61 17.27,35.56 v17.27,33.78
  Bottom 0.254: LCD.37 22.62,5.86 v21.97,5.21 | v16,27.56 16.89,28.45 16.89,33.4 v17.27,33.78 18.16,34.67 19.3,34.67 19.81,35.18 20.32,35.18 20.83,35.69 21.34,35.69 21.84,36.2 22.35,36.2 22.99,36.83 LCD_LIME2.31
  Bottom 0.762: v22.99,47.62 LCD_LIME.31
  Bottom 1.016: v16,27.56 LCD_CON.31
LCD_DE  (via drill 0.6)
  Top 0.254: v22.61,43.18 22.61,42.55 19.81,39.75 19.81,38.86 16,35.05 v16,33.78
  Bottom 0.254: LCD.9 8.62,19.68 | 8.62,19.68 8.62,20.3 9.4,21.08 13.97,21.08 15.11,22.23 15.11,27.94 16,28.83 | 8.62,19.68 8.64,19.68 | 8.62,19.68 7.75,19.68
  Bottom 0.762: 22.99,43.18 LCD_LIME2.32 | v22.61,43.18 22.99,43.18 | 22.99,43.18 LCD_LIME.32
  Bottom 1.016: 16,28.83 LCD_CON.32 v16,33.78 | 7.75,19.68 R3.2
LCD_G0  (via drill 0.6)
  Top 0.254: v34.42,47.62 34.42,47.37 37.08,44.7 37.08,36.83 40.13,33.78 v40.13,33.53
  Bottom 0.254: 38.86,22.48 38.1,21.72 36.83,21.72 29.21,14.1 21.59,14.1 17.62,10.13 LCD.27 | LCD_CON.13 38.86,27.56 40.13,28.83 v40.13,33.53 40.13,33.78 39.24,34.67 37.72,34.67 36.7,35.69 35.56,35.69 34.42,36.83 LCD_LIME2.13
  Bottom 0.762: v34.42,47.62 LCD_LIME.13
  Bottom 1.016: 38.86,22.48 LCD_CON.13
LCD_G1  (via drill 0.6)
  Top 0.254: v38.86,33.78 38.86,34.29 36.2,36.96 v36.2,39.37
  Bottom 0.254: 38.86,29.21 37.97,28.32 37.97,23.11 37.08,22.23 36.58,22.23 28.96,14.61 21.34,14.61 17.12,10.39 LCD.26 | v36.2,39.37 36.2,39.62 35.56,40.26 35.05,40.26 34.42,40.89 LCD_LIME2.14
  Bottom 0.762: LCD_LIME2.14 LCD_LIME.14
  Bottom 1.016: 38.86,29.21 LCD_CON.14 v38.86,33.78
LCD_G2  (via drill 0.6)
  Top 0.254: 34.29,46.48 v33.15,47.62
  Top 0.508: 34.29,46.48 35.18,45.59 35.18,36.32 37.59,33.91 v37.59,33.53
  Bottom 0.254: LCD.25 16.62,10.65 21.08,15.11 28.57,15.11 28.7,15.24
  Bottom 0.508: 28.7,15.24 36.32,22.86 36.32,23.24 | 36.32,26.92 37.34,27.94 37.34,33.53 | LCD_LIME2.15 33.15,36.58 33.78,35.94 34.29,35.94 35.18,35.05 36.45,35.05 37.34,34.16 37.34,33.53 | 37.34,33.53 v37.59,33.53
  Bottom 0.762: v33.15,47.62 LCD_LIME.15
  Bottom 1.016: 36.32,23.24 LCD_CON.15 36.32,26.92
LCD_G3  (via drill 0.6)
  Top 0.508: v33.27,46.23 34.42,45.09 34.42,35.94 36.32,34.04 v36.32,33.66
  Bottom 0.254: LCD.24 16.12,10.91 20.83,15.62 27.94,15.62 28.07,15.75 | LCD_LIME2.16 33.15,40.89
  Bottom 0.508: 36.32,28.45 35.31,27.43 35.31,22.99 28.07,15.75 | v33.27,46.23 33.15,46.1 LCD_LIME2.16
  Bottom 0.762: LCD_LIME2.16 LCD_LIME.16
  Bottom 1.016: 36.32,28.45 LCD_CON.16 v36.32,33.66
LCD_G4  (via drill 0.6)
  Top 0.508: v31.88,47.62 31.88,47.37 32.26,46.99 32.26,42.04 33.66,40.64 33.66,35.56 35.05,34.16 v35.05,33.78
  Bottom 0.254: 27.43,16.26 27.3,16.13 20.57,16.13 15.62,11.18 LCD.23
  Bottom 0.508: 27.43,16.26 33.78,22.61 33.78,22.99 | 33.78,27.05 35.05,28.32 v35.05,33.78 35.05,34.04 33.91,35.18 33.27,35.18 31.88,36.58 LCD_LIME2.17
  Bottom 0.762: v31.88,47.62 LCD_LIME.17
  Bottom 1.016: 33.78,22.99 LCD_CON.17 33.78,27.05
LCD_G5  (via drill 0.6)
  Top 0.508: v33.78,33.78 33.78,34.29 32.89,35.18 32.89,40.26 31.5,41.66 31.5,46.23 v31.24,46.48
  Bottom 0.254: LCD.22 15.12,11.44 20.32,16.64 26.67,16.64 26.8,16.76
  Bottom 0.508: 33.78,28.57 32.77,27.56 32.77,22.73 26.8,16.76
  Bottom 0.762: LCD_LIME2.18 LCD_LIME.18 31.88,45.85 v31.24,46.48
  Bottom 1.016: 33.78,28.57 LCD_CON.18 v33.78,33.78
LCD_G6  (via drill 0.6)
  Top 0.508: v32.51,33.78 32.51,34.42 32.13,34.8 32.13,39.88 29.84,42.16 29.84,46.61 30.61,47.37 v30.61,47.62
  Bottom 0.254: LCD.21 14.62,11.7 20.07,17.14 26.04,17.14 26.16,17.27
  Bottom 0.508: 26.16,17.27 31.24,22.35 31.24,22.73 | 31.24,27.18 32.26,28.19 32.26,33.78 | LCD_LIME2.19 30.61,36.58 32.26,34.92 32.26,33.78 | 32.26,33.78 v32.51,33.78
  Bottom 0.762: v30.61,47.62 LCD_LIME.19
  Bottom 1.016: 31.24,22.73 LCD_CON.19 31.24,27.18
LCD_G7  (via drill 0.6)
  Top 0.508: v31.24,33.78 31.37,33.91 31.37,38.86 v31.11,39.12
  Bottom 0.254: LCD.20 14.12,11.96 19.81,17.65 25.4,17.65 25.53,17.78
  Bottom 0.508: 31.24,28.7 30.23,27.69 30.23,22.48 25.53,17.78 | v31.11,39.12 30.61,39.62 LCD_LIME2.20
  Bottom 0.762: LCD_LIME2.20 LCD_LIME.20
  Bottom 1.016: 31.24,28.7 LCD_CON.20 v31.24,33.78
LCD_HSYNC  (via drill 0.6)
  Top 0.254: v23.75,46.61 23.75,45.21 25.27,43.69 25.27,42.93 21.34,38.99 21.34,38.1 19.81,36.58 v19.81,33.78
  Bottom 0.254: LCD.11 9.62,14.32 13.84,18.54 | 13.84,18.54 12.7,19.68 | 13.84,18.54 17.53,22.23 18.16,22.23 18.54,22.61 | LCD_LIME2.29 24.26,36.83 23.62,36.2 23.11,36.2 22.61,35.69 22.1,35.69 21.59,35.18 21.08,35.18 19.81,33.91 v19.81,33.78 19.43,33.4 19.43,28.45 18.54,27.56
  Bottom 0.508: v23.75,46.61 24,46.86 24,47.75 24.26,48.01 LCD_LIME.29
  Bottom 1.016: 12.7,19.68 R5.2 | 18.54,22.61 LCD_CON.29 18.54,27.56
LCD_L/R  (via drill 0.6)
  Top 0.254: v24,9.14 24.51,9.65 33.4,9.65 35.18,7.87 39.24,7.87 v42.8,11.43
  Bottom 0.254: LCD.39 23.62,8.63 24,9.02 v24,9.14
  Bottom 1.016: v42.8,11.43 42.67,11.56 R25.2 R31.1 41.66,15.75 L/R.1
LCD_PWRE  (via drill 0.6)
  Top 0.254: v10.92,21.97 12.45,20.45 30.61,20.45 36.07,14.99 51.18,14.99 v51.44,15.24 | 79.88,3.81 75.69,3.81 73.15,6.35 61.85,6.35 60.58,7.62 v51.44,7.62 | v12.19,33.78 12.19,35.31 17.65,40.77 18.54,40.77 20.57,42.8 20.57,47.5 v20.45,47.62
  Top 0.762: 79.88,3.81 v84.58,3.81
  Bottom 0.254: v51.44,15.24 v51.44,7.62 | 10.92,26.92 12.19,28.19 v12.19,33.78 14.1,35.69 18.8,35.69 19.3,36.2 19.81,36.2 20.45,36.83 LCD_LIME2.35
  Bottom 0.762: v84.58,3.81 83.57,3.81 CTRL/EN.3 | v20.45,47.62 LCD_LIME.35
  Bottom 1.016: v10.92,21.97 LCD_CON.35 10.92,26.92
LCD_R0  (via drill 0.6)
  Top 0.254: v42.29,17.91 44.7,17.91 v48.77,21.97
  Top 0.508: v39.5,47.62 39.75,47.37 39.75,45.97 44.58,41.15 44.58,38.73 v44.83,38.48 45.09,38.48 50.29,33.27 v50.29,32.77
  Bottom 0.254: LCD.35 21.62,8.03 23.62,10.03 31.24,10.03 38.86,17.65 42.04,17.65 v42.29,17.91 | LCD_LIME2.5 39.5,37.97 40.26,38.73 44.58,38.73 v44.83,38.48
  Bottom 0.508: 49.02,26.8 50.04,27.81 50.04,32.51 v50.29,32.77
  Bottom 0.762: v39.5,47.62 LCD_LIME.5
  Bottom 1.016: v48.77,21.97 49.02,22.23 LCD_CON.5 49.02,26.8
LCD_R1  (via drill 0.6)
  Top 0.508: v48.26,33.78 48.26,34.16 44.96,37.47 44.32,37.47 43.81,37.97 43.81,39.37 v43.56,39.62
  Bottom 0.254: 49.02,29.21 47.75,27.94 47.75,22.73 44.96,19.94 43.05,19.94 41.27,18.16 38.61,18.16 30.99,10.54 23.37,10.54 21.12,8.29 LCD.34 | LCD_LIME2.6 39.62,41.4 39.62,40.89 40.26,40.26 42.93,40.26 v43.56,39.62
  Bottom 0.762: LCD_LIME2.6 LCD_LIME.6
  Bottom 1.016: 49.02,29.21 LCD_CON.6 49.02,33.02 v48.26,33.78
LCD_R2  (via drill 0.6)
  Top 0.254: v38.23,47.62 39.12,46.74 39.12,45.72 42.67,42.16 42.67,38.1 43.94,36.83 44.7,36.83 47.37,34.16 47.37,32.26 v47.75,31.88
  Bottom 0.254: 45.97,22.35 44.07,20.45 42.8,20.45 41.02,18.67 38.35,18.67 30.73,11.05 23.11,11.05 20.62,8.55 LCD.33 | LCD_CON.7 46.48,27.56 47.75,28.83 v47.75,31.88 47.37,32.26 47.37,34.16 46.1,35.43 40.77,35.43 40.01,36.2 38.48,36.2 38.23,36.45 LCD_LIME2.7
  Bottom 0.762: v38.23,47.62 LCD_LIME.7
  Bottom 1.016: 45.97,22.35 46.48,22.86 LCD_CON.7
LCD_R3  (via drill 0.6)
  Top 0.254: v38.23,46.35 38.23,45.85 42.16,41.91 42.16,37.85 43.69,36.32 44.45,36.32 46.48,34.29 v46.48,33.78
  Bottom 0.254: 46.48,29.21 45.09,27.81 45.09,22.48 43.56,20.95 42.55,20.95 40.77,19.18 38.1,19.18 30.48,11.56 22.86,11.56 20.12,8.82 LCD.32
  Bottom 0.762: 38.23,44.7 LCD_LIME2.8 | 38.23,44.7 LCD_LIME.8 | v38.23,46.35 38.23,44.7
  Bottom 1.016: 46.48,29.21 LCD_CON.8 v46.48,33.78
LCD_R4  (via drill 0.6)
  Top 0.254: v36.96,47.62 36.96,46.35 40.64,42.67 40.64,38.61 45.21,34.04 v45.21,33.78
  Bottom 0.254: 43.43,22.61 40.51,19.68 37.85,19.68 30.23,12.06 22.61,12.06 19.62,9.08 LCD.31 | LCD_CON.9 43.94,27.56 45.21,28.83 v45.21,33.78 44.07,34.92 40.51,34.92 39.75,35.69 38.23,35.69 36.96,36.96 LCD_LIME2.9
  Bottom 0.762: v36.96,47.62 LCD_LIME.9
  Bottom 1.016: 43.43,22.61 43.94,23.11 LCD_CON.9
LCD_R5  (via drill 0.6)
  Top 0.254: v43.94,33.78 43.94,34.54 39.75,38.73 v39.75,39.5
  Bottom 0.254: 43.94,29.21 42.42,27.69 42.42,22.35 40.26,20.19 37.59,20.19 29.97,12.57 22.35,12.57 19.12,9.34 LCD.30 | v39.75,39.5 38.99,40.26 37.59,40.26 36.96,40.89 LCD_LIME2.10
  Bottom 0.762: LCD_LIME2.10 LCD_LIME.10
  Bottom 1.016: 43.94,29.21 LCD_CON.10 v43.94,33.78
LCD_R6  (via drill 0.6)
  Top 0.254: v35.69,47.62 35.69,46.86 38.86,43.69 38.86,37.34 v42.67,33.53
  Bottom 0.254: 41.4,22.61 39.5,20.7 37.34,20.7 29.72,13.08 22.1,13.08 18.62,9.6 LCD.29 | LCD_CON.11 41.4,27.56 42.67,28.83 v42.67,33.53 41.78,34.42 40.26,34.42 39.5,35.18 37.97,35.18 36.96,36.2 36.32,36.2 35.69,36.83 LCD_LIME2.11
  Bottom 0.762: v35.69,47.62 LCD_LIME.11
  Bottom 1.016: 41.4,22.61 LCD_CON.11
LCD_R7  (via drill 0.6)
  Top 0.254: v41.4,33.53 41.4,34.04 37.97,37.47 v37.97,39.37
  Bottom 0.254: 41.4,29.21 40.13,27.94 40.13,22.23 39.12,21.21 37.08,21.21 29.46,13.59 21.84,13.59 18.12,9.87 LCD.28 | v37.97,39.37 37.72,39.37 36.83,40.26 36.32,40.26 35.69,40.89 LCD_LIME2.12
  Bottom 0.762: LCD_LIME2.12 LCD_LIME.12
  Bottom 1.016: 41.4,29.21 LCD_CON.12 v41.4,33.53
LCD_U/D  (via drill 0.6)
  Top 0.254: v25.27,8.76 26.8,7.24 36.83,7.24 36.96,7.37 39.24,7.37 39.62,6.99 v42.93,6.99
  Bottom 0.254: LCD.40 24.12,8.12 24.26,8.26 24.77,8.26 v25.27,8.76
  Bottom 1.016: R30.1 U/D.1 R24.2 v42.93,6.99
LCD_VSYNC  (via drill 0.6)
  Top 0.254: v24.38,43.31 24,42.93 24,42.42 20.83,39.24 20.83,38.35 18.54,36.07 v18.54,33.78
  Bottom 0.254: LCD.10 9.12,18.77 9.65,19.3 | 18.54,28.83 17.65,27.94 17.65,23.11 15.11,20.57 10.54,20.57 10.03,20.07
  Bottom 0.762: 24.26,43.31 LCD_LIME2.30 | 24.26,43.31 LCD_LIME.30 | v24.38,43.31 24.26,43.31
  Bottom 1.016: 18.54,28.83 LCD_CON.30 v18.54,33.78 | 9.65,19.3 R4.2 10.03,20.07
N$1
  Bottom 0.254: LCD.8 8.12,10.04 7.49,10.67
  Bottom 1.016: R7.2 R6.2 7.49,10.67
N$2
  Bottom 1.016: D4.3 C14.2
N$3  (via drill 0.6)
  Top 0.762: v74.3,6.99 74.17,7.11 62.23,7.11 60.96,8.38 52.7,8.38 v52.58,8.51
  Top 1.016: v40.77,47.62 41.27,48.13 43.43,48.13 47.12,44.45 47.12,40.01 v51.05,36.07 56.9,30.23 v56.9,29.72 | v52.7,25.91 v56.9,25.91
  Bottom 0.508: LCD_LIME2.3 40.77,36.58 41.27,36.07 v51.05,36.07
  Bottom 0.762: 75.82,3.3 76.33,2.79 80.77,2.79 CTRL/EN.1 | v52.58,8.51 52.58,12.06 53.85,13.34 53.85,20.19 52.7,21.34 | v40.77,47.62 LCD_LIME.3
  Bottom 1.016: 75.82,3.3 C22.1 R2.2 75.82,7.16 FET2.2 75.59,6.99 v74.3,6.99 | 52.7,21.34 51.56,22.48 LCD_CON.3 51.56,25.91 v52.7,25.91 | v56.9,25.91 v56.9,29.72
N$4
  Bottom 1.016: D4.2 75.76,26.73 C11.1 R11.2
N$5
  Bottom 0.508: U1.3 58.67,15.53 58.67,16.76
  Bottom 1.016: R9.1 R8.1 58.67,16.76
N$6
  Bottom 1.016: D3.1 81.98,26.73 C10.1 R10.2
N$7
  Bottom 1.016: R1.2 C21.1 72.64,14.21 FET1.2 72.14,14.71 5V_JACK/5V_LCD_CON.2
N$8
  Bottom 1.016: C22.2 R2.1 77.6,7.09 FET2.1 78.49,7.98 78.49,14.21 D1.1
N$9
  Bottom 1.016: D1.2 76.56,14.35 74.57,14.35 FET1.1 74.48,12.63 C21.2 R1.1
N$10
  Bottom 1.016: D3.3 81.11,30.61 C13.1
N$11
  Bottom 1.016: T1.3 80.39,9.74 R32.1
N$12
  Bottom 1.016: R14.2 R9.2 C6.1
N$13
  Bottom 0.508: U1.1 58.42,13.53 58.42,12.57
  Bottom 1.016: D2.A 55.91,10.16 58.09,10.16 L1.2 58.42,9.98 58.42,12.57
N$14
  Bottom 1.016: R14.1 R15.2 R13.1 57.15,17.45 Z3.1
N$15  (via drill 0.6)
  Top 0.254: v13.46,21.97 14.48,20.95 30.86,20.95 35.94,15.88 v38.35,15.88 | v14.73,33.78 14.73,34.54 19.3,39.12 19.3,40.01 21.59,42.29 21.59,45.21 22.35,45.97 22.35,46.99 v21.72,47.62
  Bottom 0.254: 13.46,26.92 14.35,27.81 14.35,33.4 v14.73,33.78 16.13,35.18 19.05,35.18 19.56,35.69 20.07,35.69 20.57,36.2 21.08,36.2 21.72,36.83 LCD_LIME2.33
  Bottom 0.762: v21.72,47.62 LCD_LIME.33
  Bottom 1.016: v13.46,21.97 LCD_CON.33 13.46,26.92 | v38.35,15.88 38.99,15.88 L/R.2
N$16
  Bottom 0.762: CTRL/EN.2 81.92,5.21
  Bottom 1.016: T1.1 81.92,6.96 81.92,5.21
N$17  (via drill 0.6)
  Top 0.254: v13.46,28.32 12.06,29.72 5.97,29.72 3.3,27.05 3.3,17.4 4.7,16 7.87,16 9.27,17.4 11.43,17.4 22.23,6.6 37.34,6.6 v37.47,6.48 | v13.46,33.78 13.46,35.81 17.91,40.26 18.8,40.26 21.08,42.55 21.08,45.97 v21.46,46.35
  Bottom 0.254: LCD_LIME.34 21.72,46.1 v21.46,46.35
  Bottom 0.508: v37.47,6.48 37.47,5.71 38.23,4.95 39.24,4.95
  Bottom 0.762: LCD_LIME.34 21.72,43.94 21.46,43.69 21.46,42.67 21.72,42.42 LCD_LIME2.34
  Bottom 1.016: v13.46,28.32 LCD_CON.34 v13.46,33.78 | 39.24,4.95 U/D.2
N$18  (via drill 0.6)
  Top 0.762: v70.74,16.13 v74.68,16.13
  Bottom 0.762: 3.3V/5V.1 70.74,11.16 v70.74,16.13
  Bottom 1.016: FET1.3 73.87,16.13 v74.68,16.13
N$19
  Bottom 1.016: D1.3 77.81,16.26 R32.2
N$20  (via drill 0.6)
  Top 1.016: v42.8,46.86 45.72,43.94 45.72,39.5 v48.13,37.08 v55.5,29.72
  Bottom 0.508: LCD_LIME2.1 42.04,36.83 47.88,36.83 v48.13,37.08
  Bottom 0.762: v42.8,46.86 42.04,47.62 LCD_LIME.1
  Bottom 1.016: LCD_CON.1 54.1,26.54 55.5,27.94 v55.5,29.72 55.5,30.35 63.37,38.23 69.6,38.23 5V_JACK/5V_LCD_CON.3
N$21
  Bottom 0.254: LCD.1 4.62,8.26 | LCD.2 5.12,8.09 4.95,8.26 4.62,8.26 | 4.62,8.26 4.62,8.71 3.3,10.03 0.89,10.03
  Bottom 0.508: 0.89,10.03 0.64,10.29 0.64,17.91 1.14,18.41
  Bottom 1.016: 1.14,18.41 VLED+_E.1
N$22
  Bottom 1.016: 5V_JACK/5V_LCD_CON.1 74.68,38.23 87.34,38.23 PWR_JACK.1
N$23
  Bottom 0.254: 5.62,8.26 LCD.3 | 5.62,8.26 5.62,8.6 3.68,10.54 1.52,10.54 1.4,10.67 | LCD.4 6.12,8.1 5.97,8.26 5.62,8.26
  Bottom 0.508: 1.65,16.38 1.4,16.13 1.4,10.67
  Bottom 1.016: 1.65,16.38 VLED-_E.1
N$42  (via drill 0.6)
  Top 0.254: v30.61,8.13 33.02,8.13 v33.27,8.38
  Bottom 0.254: LCD.47 27.62,8.19 27.81,8.38 30.35,8.38 v30.61,8.13
  Bottom 1.016: v33.27,8.38 R20.2 R19.2
N$123
  Bottom 0.508: L2.2 85.67,14.99 88.49,14.99 U2.1
  Bottom 1.016: C14.1 C13.2 84.84,32.38 85.34,31.88 85.34,17.91 | 85.34,17.91 D5.A | L2.2 85.34,17.91
N$126  (via drill 0.6)
  Top 0.762: v91.57,12.7 91.44,12.83 v91.44,14.99
  Bottom 0.508: U2.3 90.48,14.99 v91.44,14.99
  Bottom 1.016: R26.1 R18.1 93.34,10.92 v91.57,12.7
RESET
  Bottom 0.254: LCD.44 26.12,8.21 27.43,9.53 32.13,9.53 33.78,11.18
  Bottom 1.016: 34.42,11.81 R23.2 | C20.1 35.69,13.08 34.42,11.81 | 33.78,11.18 34.42,11.81
TPX1  (via drill 0.6)
  Top 0.254: v93.09,4.95 90.17,7.87 62.61,7.87 61.09,9.4 48.39,9.4 v45.97,11.81 45.47,12.32 34.92,12.32 29.34,17.91 9.02,17.91 7.62,16.51 4.95,16.51 3.81,17.65 3.81,20.83 5.46,22.48 7.87,22.48 v8.38,21.97 | v9.65,35.56 10.16,35.56 15.88,41.27 15.88,46.61 v16.76,47.5
  Bottom 0.254: v16.76,47.5 16.89,47.62 18.92,47.62 19.18,47.88 | 8.38,26.92 9.65,28.19 v9.65,35.56 10.29,36.2 18.54,36.2 19.18,36.83 LCD_LIME2.37
  Bottom 0.508: LCD.55 46.66,12.5 v45.97,11.81 44.2,10.03 | LCD.51 92.86,5.18 v93.09,4.95
  Bottom 0.762: 19.18,47.88 LCD_LIME.37
  Bottom 1.016: v8.38,21.97 LCD_CON.37 8.38,26.92 | 44.2,10.03 R27.2
TPX2  (via drill 0.6)
  Top 0.254: v8.38,28.32 11.18,25.53 46.86,25.53 49.66,22.73 49.66,18.54 v48.77,17.65 | v94.87,4.83 94.74,4.95 94.74,8.64 94.11,9.27 62.74,9.27 61.59,10.41 50.04,10.41 v48.77,11.68 | v8.38,33.78 9.14,33.78 16.38,41.02 16.38,45.85 v16.76,46.23
  Bottom 0.254: LCD_LIME.38 19.18,45.47 18.54,46.1 16.89,46.1 v16.76,46.23
  Bottom 0.508: LCD.57 48.66,17.76 v48.77,17.65 v48.77,11.68 | LCD.53 v94.87,4.83
  Bottom 0.762: LCD_LIME.38 LCD_LIME2.38
  Bottom 1.016: v8.38,28.32 LCD_CON.38 v8.38,33.78
TPY1  (via drill 0.6)
  Top 0.254: v93.73,8.38 62.87,8.38 61.34,9.91 49.28,9.91 v47.5,11.68 46.35,12.83 35.18,12.83 29.59,18.41 8.76,18.41 7.37,17.02 5.21,17.02 4.32,17.91 4.32,20.07 v5.84,21.59 | v7.11,33.78 7.11,34.29 9.27,36.45 10.29,36.45 15.37,41.53 15.37,47.37 v16.76,48.77
  Bottom 0.254: 5.84,26.92 7.11,28.19 v7.11,33.78 7.11,34.29 9.53,36.7 17.91,36.7 LCD_LIME2.39
  Bottom 0.508: LCD.52 93.86,8.24 v93.73,8.38 | LCD.56 47.66,11.85 v47.5,11.68 44.32,8.51
  Bottom 0.762: v16.76,48.77 17.91,48.77 LCD_LIME.39
  Bottom 1.016: 44.32,8.51 R28.2 | v5.84,21.59 LCD_CON.39 5.84,26.92
TPY2  (via drill 0.6)
  Top 0.254: v5.84,28.32 6.73,29.21 8.76,29.21 11.94,26.04 47.12,26.04 50.55,22.61 v50.55,20.95 | v95.76,8.38 94.36,9.78 62.99,9.78 61.85,10.92 51.44,10.92 v49.91,12.45
  Bottom 0.254: LCD_LIME2.40 17.91,40.13 14.99,37.21 9.27,37.21 5.84,33.78
  Bottom 0.508: v50.55,20.95 50.42,20.95 49.66,20.2 LCD.58 49.66,18.53 49.91,18.29 v49.91,12.45 | LCD.54 95.86,8.28 v95.76,8.38
  Bottom 0.762: LCD_LIME2.40 LCD_LIME.40
  Bottom 1.016: v5.84,28.32 LCD_CON.40 5.84,33.78
VCC  (via drill 0.6)
  Top 1.016: 7.49,10.29 v7.49,14.61 8.64,14.61 v10.03,16 | 7.49,10.29 7.49,5.71 10.03,3.17 22.99,3.17 24.26,4.45 28.32,4.45 29.08,5.21 38.73,5.21 | 7.49,10.29 v6.1,10.29 | 38.73,5.21 v38.73,6.48 | 38.73,5.21 42.8,5.21 v44.07,3.94 | v72.01,4.7 67.31,4.7 PWR.5
  Bottom 0.254: v6.1,10.29 7.62,8.76 LCD.7
  Bottom 0.762: 3.3V/5V.3 71.97,7.83 72.01,7.83
  Bottom 1.016: v6.1,10.29 5.21,10.29 4.45,11.05 C2.1 2.67,11.68 C1.1 | R5.1 R4.1 v10.03,16 | v7.49,14.61 R6.1 | R27.1 R28.1 R24.1 39.24,6.99 v38.73,6.48 | R27.1 R25.1 | 36.2,10.03 R19.1 | 36.2,10.03 R23.1 | PWR.5 63.25,3.94 53.98,3.94 | v44.07,3.94 53.98,3.94 | R13.2 54.99,18.67 54.99,12.32 53.98,11.3 53.98,3.94 | FET2.3 73.49,9.36 71.97,7.83 | v72.01,4.7 72.01,7.83 | R27.1 36.2,10.03
VCOM  (via drill 0.6)
  Top 0.254: 61.72,1.65 61.09,1.02 41.53,1.02 39.12,3.43 v35.81,3.43
  Top 0.508: v27.05,5.71 24,5.71 22.48,4.19 10.92,4.19 v10.29,4.83
  Top 1.016: 61.72,1.65 PWR.4
  Bottom 0.254: 33.53,6.86 31.37,9.02 27.69,9.02 27.12,8.45 LCD.46 27.12,5.78 v27.05,5.71 | LCD.6 7.12,6.09 8.38,4.83 v10.29,4.83
  Bottom 1.016: 34.54,3.51 Z4.1 34.42,3.63 R29.1 C19.1 33.53,6.86 | 34.54,3.51 34.42,3.51 R22.2 | 34.54,3.51 34.62,3.43 v35.81,3.43
VLED+  (via drill 0.6)
  Top 0.508: v5.97,20.19 4.95,19.18 4.95,18.16 5.46,17.65 7.11,17.65 8.51,19.05 29.97,19.05 35.56,13.46 59.31,13.46 v60.2,14.35 62.1,14.35 v64.52,11.94
  Top 0.762: 71.37,0.89 71.5,0.76 73.41,0.76 73.53,0.89
  Top 1.016: PWR.7 71.37,0.89 | 73.53,0.89 97.54,0.89 98.81,2.16 v98.81,10.86
  Bottom 0.508: v60.2,14.35 60.33,14.48 U1.5 | 64.52,5.21 64.26,4.95 57.78,4.95 57.53,5.21
  Bottom 1.016: VLED+_E.2 4.45,20.19 v5.97,20.19 | PWR.7 68.07,4.19 65.53,4.19 64.52,5.21 C3.1 C4.1 C5.1 v64.52,11.94 | D2.K 55.98,5.21 57.53,5.21
  Bottom 2.032: VLED+.1 98.3,11.94
  Bottom 2.159: 99.31,11.94 VLED+.1 v98.81,10.86
VLED-  (via drill 0.6)
  Top 0.508: v5.97,18.67 6.99,18.67 8.13,19.81 30.35,19.81 35.94,14.22 58.42,14.22 61.47,17.27 v62.74,17.27
  Top 1.016: v62.74,17.27 62.87,17.4 98.68,17.4 v98.81,17.27
  Bottom 1.016: VLED-_E.2 4.45,17.14 v5.97,18.67 | R8.2 v62.74,17.27 R12.1
  Bottom 2.032: VLED-.1 98.3,18.41
  Bottom 2.159: 99.31,18.41 VLED-.1 v98.81,17.27

### Text on the board
bNames: LCD-OLINUXINO-10''TS | Rev.A | (C) 2014 | WWW.OLIMEX.COM | +5V_ONLY | 1 | 3.3V/ | +20V | +10.8V | 5V | +3.75V | +3.3V | -8.2V | 9.7V | GND